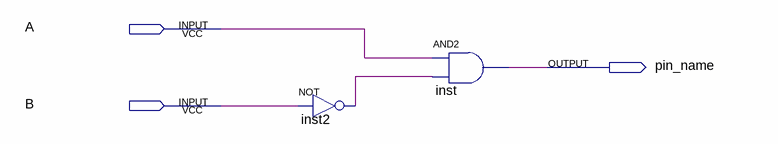
[diagram p0: schematic sheet]
// Quartus schematic amaiorb.bdf as structural Verilog: 2 symbols, 3 pins
module amaiorb (
  input  A,
  input  B,
  output pin_name
);

  wire inst2_out;

  not inst2 (inst2_out, B);
  and inst (pin_name, A, inst2_out);
endmodule
